# EAGLE design soundplank (EAGLE 6.2)
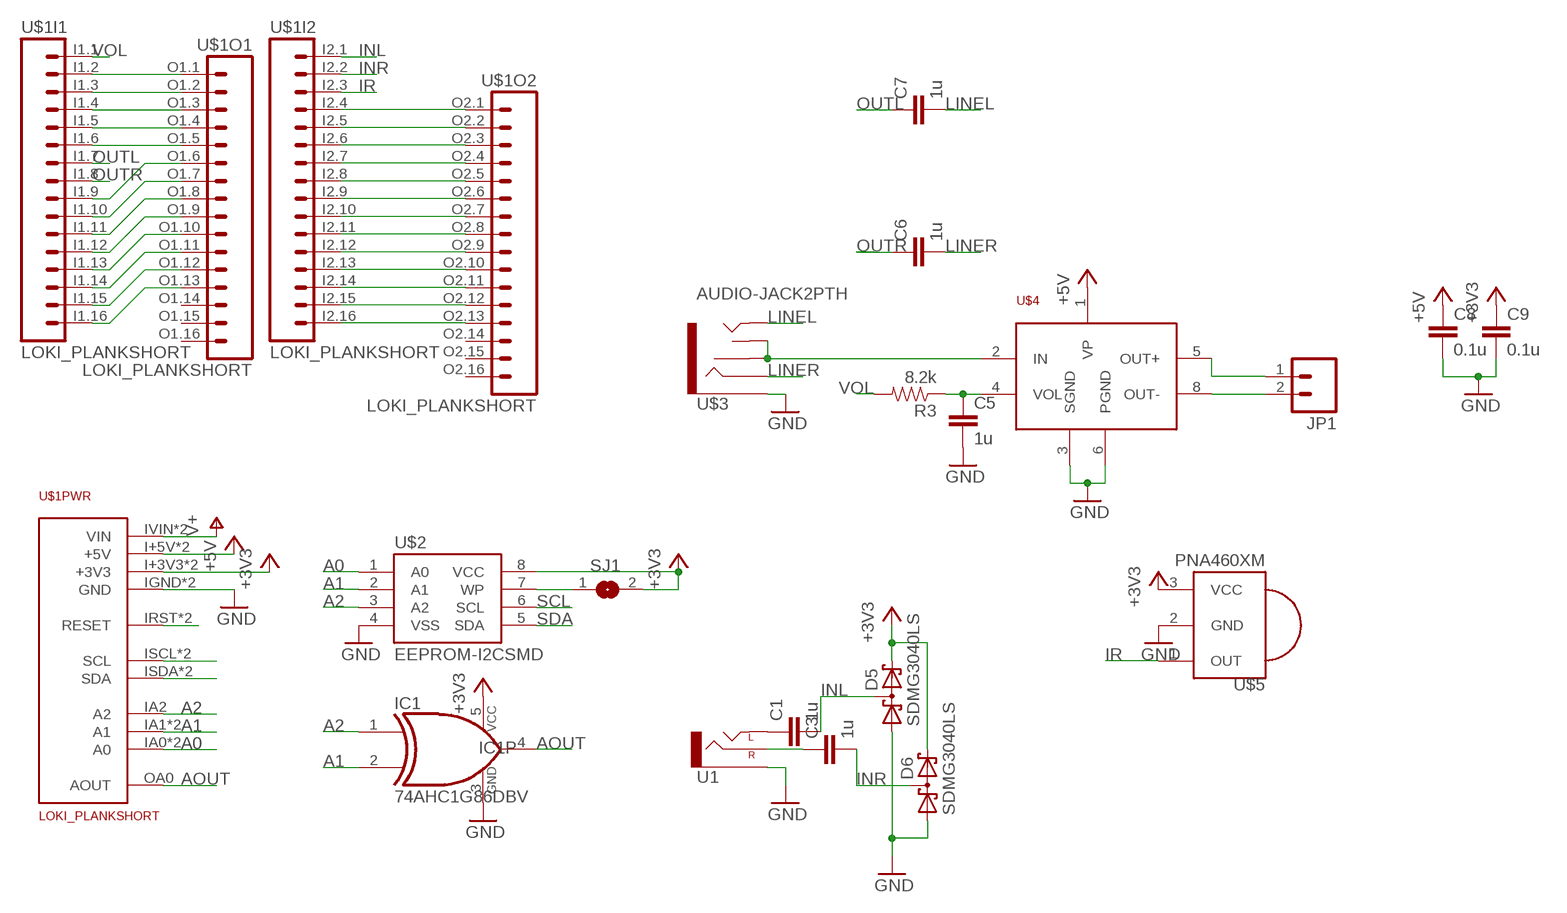
[diagram p0: schematic, sheet 1]

## Parts
C1  1u  CAP1210  [1210]
C3  1u  CAP1210  [1210]
C5  1u  CAP0805  [0805]
C6  1u  CAP1210  [1210]
C7  1u  CAP1210  [1210]
C8  0.1u  CAP0805  [0805]
C9  0.1u  CAP0805  [0805]
D5  SDMG3040LS  BAS40-04  [SOT23]
D6  SDMG3040LS  BAS40-04  [SOT23]
IC1  74AHC1G86DBV  [SOT23-5]
JP1  M023.5MM  [SCREWTERMINAL-3.5MM-2]
R3  8.2k  RESISTOR0805-RES  [0805]
SJ1  SJ  [SJ]
U1  AUDIO-JACKPTH  [AUDIO-JACK]
U$1  LOKI_PLANKSHORT  [PLANK_SHORT]
U$2  EEPROM-I2CSMD  [SO08]
U$3  AUDIO-JACK2PTH  [AUDIO-JACK]
U$4  TDA7052A  [SO08-MAX6675]
U$5  PNA460XM  [PNA460XM]

## Nets
+3V3: C9.1 D5.2(C2) D6.2(C2) IC1.5(VCC) SJ1.2 U$1.I+3V3(PWR:+3V3) U$1.O+3V3(PWR:+3V3) U$2.8(VCC) U$5.3(VCC)
+5V: C8.1 U$1.I+5V(PWR:+5V) U$1.O+5V(PWR:+5V) U$4.1(VP)
A0: U$1.IA0(PWR:A0) U$1.OA1(PWR:A0) U$2.1(A0)
A1: IC1.2(I1) U$1.IA1(PWR:A1) U$1.OA2(PWR:A1) U$2.2(A1)
A2: IC1.1(I0) U$1.IA2(PWR:A2) U$2.3(A2)
AOUT: IC1.4(O) U$1.OA0(PWR:AOUT)
GND: C5.2 C8.2 C9.2 D5.1(A1) D6.1(A1) IC1.3(GND) U1.SLEEVE U$1.IGND(PWR:GND) U$1.OGND(PWR:GND) U$2.4(VSS) U$3.SLEEVE U$4.3(SGND) U$4.6(PGND) U$5.2(GND)
INL: C1.2 D5.3(C1A2) U$1.I2.1
INR: C3.2 D6.3(C1A2) U$1.I2.2
IR: U$1.I2.3 U$5.1(OUT)
LINEL: C7.2 U$3.TIP
LINER: C6.2 U$3.RING
N$1: U$1.I1.2 U$1.O1.1
N$2: U$1.I1.3 U$1.O1.2
N$3: U$1.I1.4 U$1.O1.3
N$4: U$1.I1.5 U$1.O1.4
N$5: U$1.I1.6 U$1.O1.5
N$6: U$1.I1.9 U$1.O1.6
N$7: U$1.I1.10 U$1.O1.7
N$8: U$1.I1.11 U$1.O1.8
N$9: U$1.I1.12 U$1.O1.9
N$10: U$1.I1.13 U$1.O1.10
N$11: U$1.I1.14 U$1.O1.11
N$12: U$1.I1.15 U$1.O1.12
N$13: U$1.I1.16 U$1.O1.13
N$14: U$1.I2.16 U$1.O2.13
N$15: U$1.I2.15 U$1.O2.12
N$16: U$1.I2.14 U$1.O2.11
N$17: U$1.I2.13 U$1.O2.10
N$18: U$1.I2.12 U$1.O2.9
N$19: U$1.I2.11 U$1.O2.8
N$20: U$1.I2.10 U$1.O2.7
N$21: U$1.I2.9 U$1.O2.6
N$22: U$1.I2.8 U$1.O2.5
N$23: U$1.I2.7 U$1.O2.4
N$24: U$1.I2.6 U$1.O2.3
N$25: U$1.I2.5 U$1.O2.2
N$26: U$1.I2.4 U$1.O2.1
N$28: C5.1 R3.1 U$4.4(VOL)
N$30: JP1.2 U$4.8(OUT-)
N$31: SJ1.1 U$2.7(WP)
N$32: U$1.IRST(PWR:RESET) U$1.ORST(PWR:RESET)
N$33: JP1.1 U$4.5(OUT+)
N$34: C1.1 U1.TIP(LEFT)
N$38: U$3.RSH U$3.TSH U$4.2(IN)
N$39: C3.1 U1.RING(RIGHT)
OUTL: C7.1 U$1.I1.7
OUTR: C6.1 U$1.I1.8
SCL: U$1.ISCL(PWR:SCL) U$1.OSCL(PWR:SCL) U$2.6(SCL)
SDA: U$1.ISDA(PWR:SDA) U$1.OSDA(PWR:SDA) U$2.5(SDA)
V+: U$1.IVIN(PWR:VIN) U$1.OVIN(PWR:VIN)
VOL: R3.2 U$1.I1.1
Unconnected: U$1.O1.14 U$1.O1.15 U$1.O1.16 U$1.O2.14 U$1.O2.15 U$1.O2.16

## Library data of the parts
C1 C3 C5-C9 = SparkFun-Passives:CAP: Capacitor Standard 0603 ceramic capacitor, and 0.1" leaded capacitor.
D5 D6 = diode:BAS40-04: Silicon Schottky Diodes General-purpose diode for high-speed switching
IC1 = 74xx-little-us:74*1G86: 2-input EXCLUSIV-OR gate
JP1 = SparkFun-Connectors:M02: Header 2 Standard 2-pin 0.1" header. Use with straight break away headers (SKU : PRT-00116), right angle break away headers (PRT-00553), swiss pins (PRT-00743), machine pins (PRT-00117), and female headers (PRT-00115). Molex polarized connector foot print use with SKU : PRT-08233 with associated crimp pins and housings.
R3 = SparkFun-Passives:RESISTOR: Resistor Basic schematic elements and footprints for 0603, 1206, and PTH resistors.
SJ1 = jumper:SJ: SMD solder JUMPER
U1 = SparkFun-Connectors:AUDIO-JACK: 3.5mm Audio Jack Simple 3.5mm common PCB mount audio jack. SKU: PRT-08032
U$1 = loki:LOKI_PLANK: Expansion plank templates for Loki.
U$2 = SparkFun-DigitalIC:EEPROM-I2C: I2C EEPROM chips, 24LC256 (and others)
U$3 = SparkFun-Connectors:AUDIO-JACK2: Stereo audio jack with bypass switches.
U$4 = nickparts:TDA7052A
U$5 = adafruit:PNA460XM: IR 38KHz receiver PNA4602 and related receivers http://www.ladyada.net/library/pcb/eaglelibrary.html

## Board
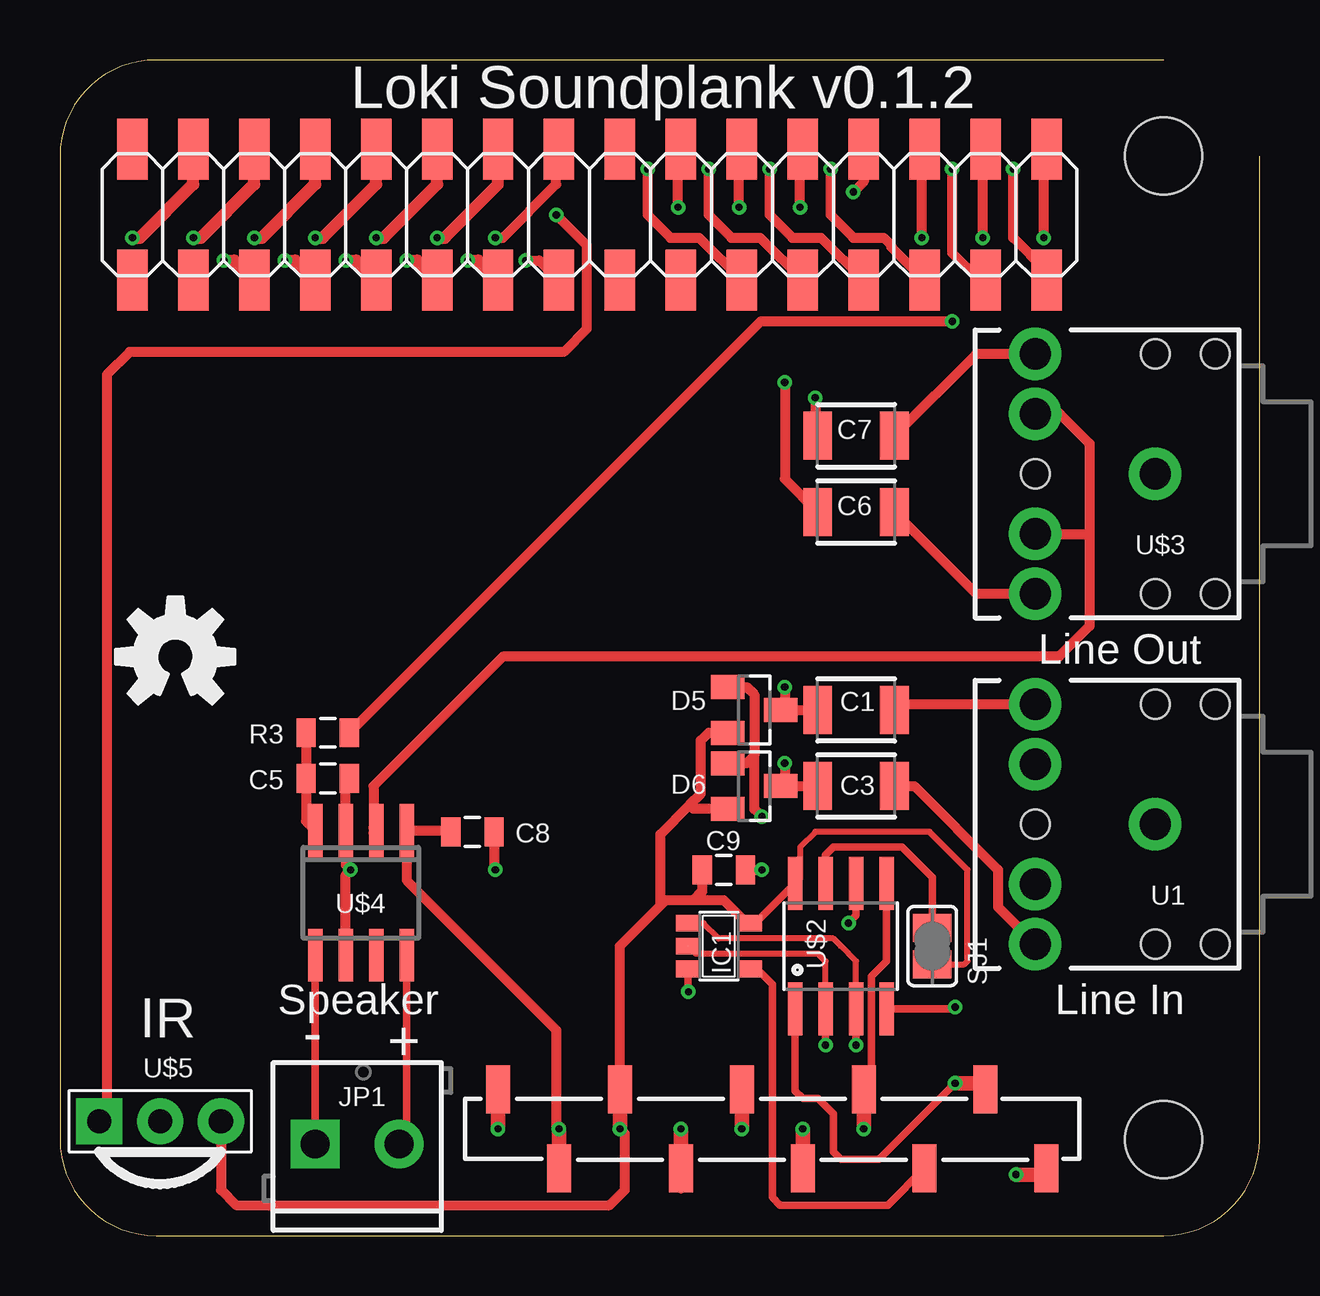
[diagram p1: board, top side]
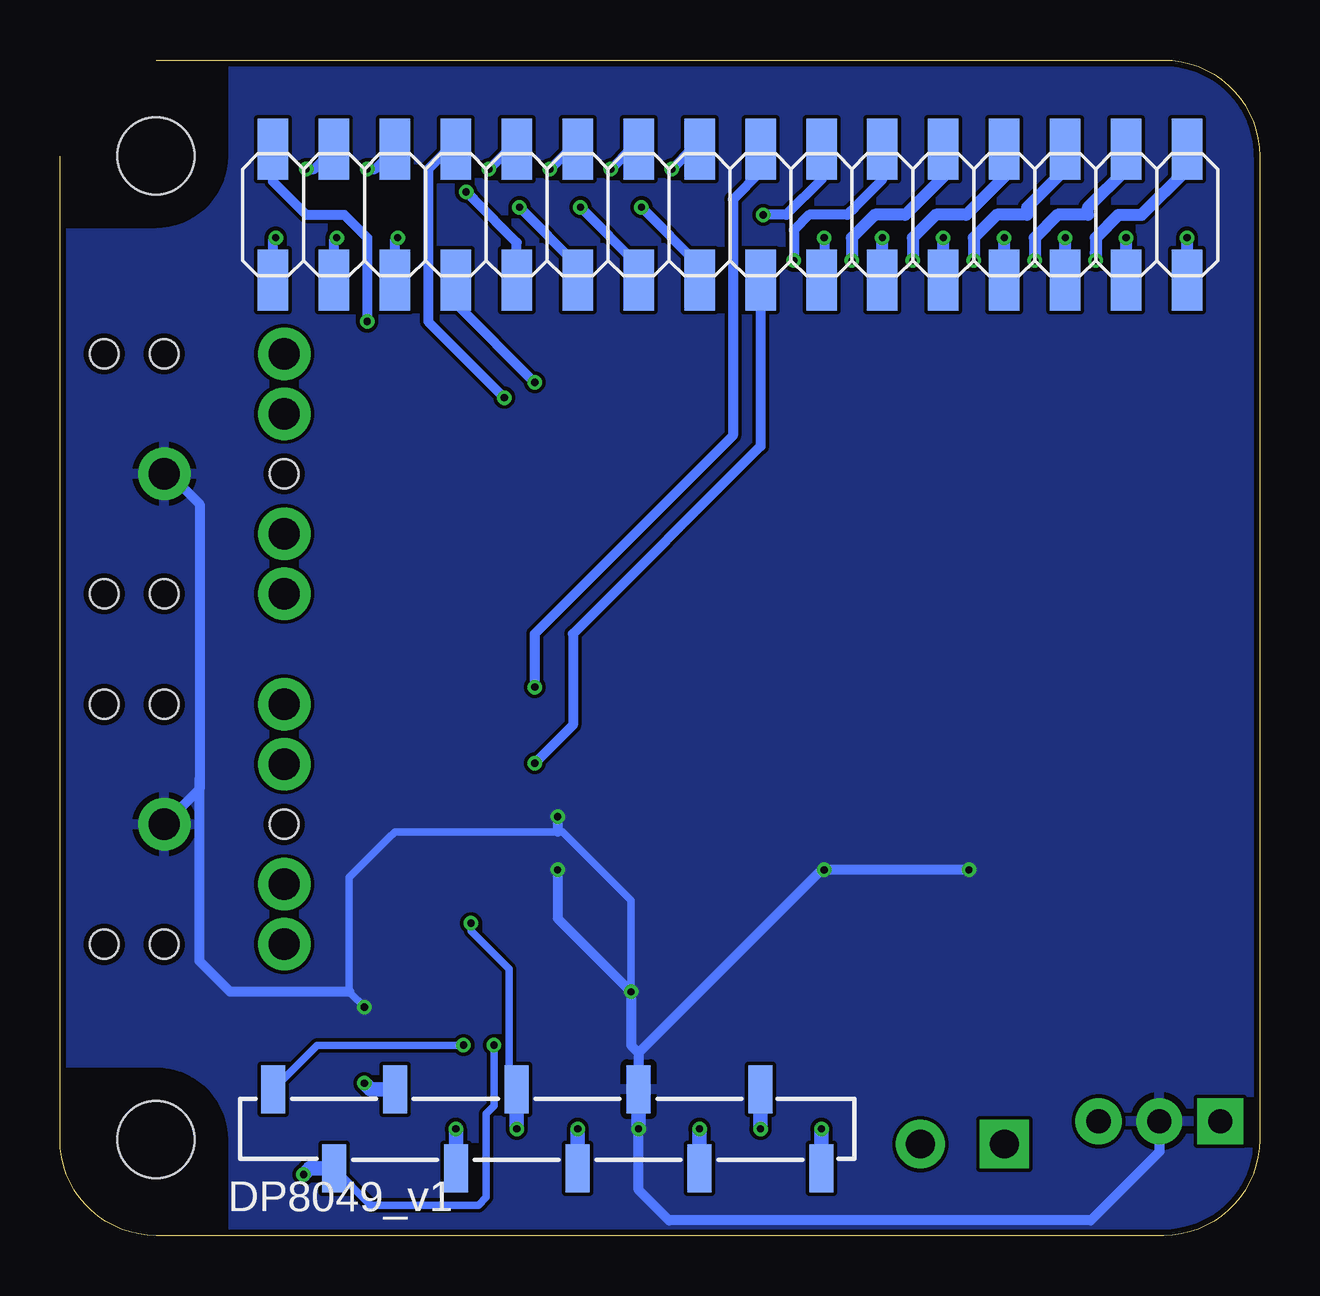
[diagram p2: board, bottom side, seen from below]

Size 50 x 49 mm. Coordinates in mm from the lower left corner, seen from the top.
Copper layers (1*16): Top 0.035mm / dielectric 1.5mm / Bottom 0.035mm
Design rules: minimum track width 6mil, minimum drill 0.3mm, track to track 6mil, track to pad 6mil, pad to pad 6mil, via to via 6mil, smd to smd 0mil, copper to edge 10mil, drill to drill 10mil, minimum pad ring 10mil, minimum via ring 6mil, stop-mask expansion 2mil, vias tented up to drill 100mil, thermal gap 10mil

### Footprints (pad centres in the part's own frame; a part is rotated, then mirrored left to right if it is on the bottom)
1210 = smd 1.2 x 2: 1 -1.6,0; 2 1.6,0
0805 = smd 0.8 x 1.2: 1 -0.9,0; 2 0.9,0
SOT23 = smd 1 x 1.4: 1 -0.95,-1.1; 2 0.95,-1.1; 3 0,1.1
SOT23-5 = smd 0.69 x 0.99: 1 -0.95,-1.29; 2 0,-1.29; 3 0.95,-1.29; 4 0.95,1.3; 5 -0.95,1.3
SCREWTERMINAL-3.5MM-2 = drill 1.2 pad 2.032 square: 1 0,0 | drill 1.2 pad 2.032: 2 3.5,0
SJ = smd 1.168 x 1.6: 1 -0.762,0; 2 0.762,0
AUDIO-JACK = drill 1.3 pad 2.184: RING 5,5; RSH 5,2.5; SLEEVE 0,0; TIP 5,-5; TSH 5,-2.5 | hole 1.2: 0,5; -2.5,5; -2.5,-5; 0,-5; 5,0
PLANK_SHORT = smd 1.27 x 2.54 bottom: I1.1 41.12,45.275; I1.2 41.12,39.815; I1.3 38.58,45.275; I1.4 38.58,39.815; I1.5 36.04,45.275; I1.6 36.04,39.815; I1.7 33.5,45.275; I1.8 33.5,39.815; I1.9 30.96,45.275; I1.10 30.96,39.815; I1.11 28.42,45.275; I1.12 28.42,39.815; I1.13 25.88,45.275; I1.14 25.88,39.815; I1.15 23.34,45.275; I1.16 23.34,39.815; I2.1 20.8,45.275; I2.2 20.8,39.815; I2.3 18.26,45.275; I2.4 18.26,39.815; I2.5 15.72,45.275; I2.6 15.72,39.815; I2.7 13.18,45.275; I2.8 13.18,39.815; I2.9 10.64,45.275; I2.10 10.64,39.815; I2.11 8.1,45.275; I2.12 8.1,39.815; I2.13 5.56,45.275; I2.14 5.56,39.815; I2.15 3.02,45.275; I2.16 3.02,39.815 | smd 1 x 2 bottom: I+3V3 23.34,2.795; I+5V 20.8,6.095; IA0 36.04,6.095; IA1 38.58,2.795; IA2 41.12,6.095; IGND 25.88,6.095; IRST 28.42,2.795; ISCL 30.96,6.095; ISDA 33.5,2.795; IVIN 18.26,2.795 | smd 1.27 x 2.54: O1.1 41.12,45.275; O1.2 41.12,39.815; O1.3 38.58,45.275; O1.4 38.58,39.815; O1.5 36.04,45.275; O1.6 36.04,39.815; O1.7 33.5,45.275; O1.8 33.5,39.815; O1.9 30.96,45.275; O1.10 30.96,39.815; O1.11 28.42,45.275; O1.12 28.42,39.815; O1.13 25.88,45.275; O1.14 25.88,39.815; O1.15 23.34,45.275; O1.16 23.34,39.815; O2.1 20.8,45.275; O2.2 20.8,39.815; O2.3 18.26,45.275; O2.4 18.26,39.815; O2.5 15.72,45.275; O2.6 15.72,39.815; O2.7 13.18,45.275; O2.8 13.18,39.815; O2.9 10.64,45.275; O2.10 10.64,39.815; O2.11 8.1,45.275; O2.12 8.1,39.815; O2.13 5.56,45.275; O2.14 5.56,39.815; O2.15 3.02,45.275; O2.16 3.02,39.815 | smd 1 x 2: O+3V3 23.34,6.095; O+5V 20.8,2.795; OA0 36.04,2.795; OA1 38.58,6.095; OA2 41.12,2.795; OGND 25.88,2.795; ORST 28.42,6.095; OSCL 30.96,2.795; OSDA 33.5,6.095; OVIN 18.26,6.095 | hole 3.2: 46,4; 46,45
SO08 = smd 0.61 x 2.21: 1 -1.905,-2.616; 2 -0.635,-2.616; 3 0.635,-2.616; 4 1.905,-2.616; 5 1.905,2.616; 6 0.635,2.616; 7 -0.635,2.616; 8 -1.905,2.616
SO08-MAX6675 = smd 0.6 x 2.2: 1 -1.905,-2.6; 2 -0.635,-2.6; 3 0.635,-2.6; 4 1.905,-2.6; 5 1.905,2.6; 6 0.635,2.6; 7 -0.635,2.6; 8 -1.905,2.6
PNA460XM = drill 1.016 pad 1.93 square: 1 -2.54,0 | drill 1.016 pad 1.93: 2 0,0; 3 2.54,0

### Placement (x,y rotation side)
C1  33.18,21.91 180 top
C3  33.18,18.73 180 top
C5  11.16,19.05 0 top
C6  33.18,30.16 0 top
C7  33.18,33.34 0 top
C8  17.19,16.83 0 top
C9  27.67,15.24 0 top
D5  28.94,21.91 270 top
D6  28.94,18.73 270 top
IC1  27.47,12.06 270 top
JP1  10.64,3.81 0 top
R3  11.16,20.95 0 top
SJ1  36.36,12.06 270 top
U1  45.65,17.14 180 top
U$1  0,0 0 top
U$2  32.55,12.06 0 top
U$3  45.65,31.75 180 top
U$4  12.54,14.29 180 top
U$5  4.18,4.76 0 top
U$6  [OSHW-LOGO-M]  4.81,24.13 0 top

### Tracks (layer width: path | path; a pad name or v marks a point on that pad's centre or on a via)
+3V3  (via drill 0.3)
  Top 0.254: SJ1.2 37.7,11.3 37.83,11.43 37.83,15.24 36.56,16.51 36.24,16.83 31.48,16.83 30.84,16.19 30.84,14.88 U$2.8
  Top 0.305: IC1.5 28.98,13.02 U$2.8
  Top 0.406: IC1.5 28.62,13.02 27.67,13.97 26.4,13.97 | 26.4,13.97 25.25,13.97 25.03,13.75 | U$1.O+3V3 23.34,12.06 25.03,13.75 | C9.1 26.77,14.34 26.4,13.97 | U$5.3 6.71,1.91 7.35,1.27 22.91,1.27 23.54,1.91 23.54,4.24 v23.34,4.45 | D6.2 26.4,17.78 26.24,17.94 | 25.03,13.75 25.03,16.73 26.24,17.94 | 26.24,17.94 26.72,18.41 26.72,20.64 27.04,20.95 D5.2
  Top 0.61: U$1.O+3V3 v23.34,4.45
  Bottom 0.61: v23.34,4.45 U$1.I+3V3
+5V  (via drill 0.3)
  Top 0.406: 20.68,4.56 v20.8,4.45 20.68,4.56 | C8.1 16.23,16.89 U$4.1 14.45,15.76 14.45,14.81 20.68,8.57 20.68,4.56
  Top 0.61: v20.8,4.45 U$1.O+5V
  Bottom 0.61: U$1.I+5V v20.8,4.45
A0  (via drill 0.3)
  Top 0.305: U$2.1 30.64,6.03 30.96,5.71 31.59,5.71 32.23,5.08 32.23,3.49 32.55,3.17 34.13,3.17 v37.31,6.35
  Top 0.61: v37.31,6.35 38.32,6.35 U$1.OA1
  Bottom 0.305: 35.98,6.03 U$1.IA0
  Bottom 0.61: U$1.IA0 37.05,6.09 v37.31,6.35
A1  (via drill 0.3)
  Top 0.254: U$2.2 31.91,11.43 31.59,11.75 26.5,11.75 IC1.2
  Top 0.305: U$2.2 v31.91,7.94
  Top 0.61: v39.85,2.54 40.86,2.54 U$1.OA2
  Bottom 0.305: U$1.IA1 37.05,1.27 32.55,1.27 32.23,1.59 32.23,5.08 31.91,5.4 v31.91,7.94
  Bottom 0.61: U$1.IA1 39.59,2.79 v39.85,2.54
A2  (via drill 0.3)
  Top 0.254: U$2.3 33.18,11.43 32.55,12.06 32.23,12.38 27.47,12.38 26.83,13.02 IC1.1
  Top 0.305: U$2.3 v33.18,7.94
  Bottom 0.305: v33.18,7.94 39.28,7.94 U$1.IA2
AOUT
  Top 0.305: IC1.4 29.05,11.12 29.69,10.48 29.69,1.59 30.01,1.27 34.51,1.27 U$1.OA0
GND  (via drill 0.3)
  Top 0.305: 25.88,1.91 U$1.OGND | IC1.3 26.18,10.18 v26.2,10.16 | U$2.4 35.29,9.45 37.23,9.45 v37.31,9.53
  Top 0.406: C8.2 18.09,15.29 v18.14,15.24 | C9.2 v29.26,15.24 | C5.2 11.91,18.9 U$4.3 11.91,15.44 v12.11,15.24 11.91,15.04 U$4.6 | D6.1 | D5.1 28.62,22.86 28.94,22.54 28.94,20 | 28.94,20 28.62,19.68 D6.1 | v29.26,17.46 28.94,17.78 28.94,20
  Top 0.61: v25.88,4.45 U$1.OGND
  Bottom 0.305: v37.31,9.53 37.89,10.1 37.95,10.16 37.95,14.92 36.2,16.67 36.14,16.73 36.04,16.83 29.26,16.83 29.05,16.83 29,16.77 26.2,13.97 v26.2,10.16
  Bottom 0.406: v12.11,15.24 v18.14,15.24 18.26,15.24 25.88,7.62 | 25.88,7.62 U$1.IGND | 25.88,7.62 26.2,7.94 v26.2,10.16 29.26,13.22 v29.26,15.24 | U$5.2 4.18,3.49 7.03,0.64 24.61,0.64 25.88,1.91 v25.88,4.45 | v29.26,17.46 29.26,16.83 | U$3.SLEEVE 45.45,31.75 44.18,30.48 44.18,19.05 | 44.18,19.05 44.18,18.62 U1.SLEEVE | 37.95,10.16 42.91,10.16 44.18,11.43 44.18,19.05
  Bottom 0.61: U$1.IGND v25.88,4.45
  pour Bottom: -0.27,0 -0.27,49.53 50.53,49.53 50.53,0
INL  (via drill 0.3)
  Top 0.406: C1.2 D5.3 30.21,22.08 v30.21,22.86
  Bottom 0.406: U$1.I2.1 20.8,44.34 21.96,43.18 21.96,33.34 30.21,25.08 v30.21,22.86
INR  (via drill 0.3)
  Top 0.406: C3.2 D6.3 30.21,18.9 v30.21,19.68
  Bottom 0.406: U$1.I2.2 20.8,32.91 28.62,25.08 28.62,21.27 v30.21,19.68
IR  (via drill 0.3)
  Top 0.406: v20.68,42.55 21.96,41.27 21.96,37.78 21,36.83 2.9,36.83 1.95,35.88 1.95,31.43 1.95,5.08 U$5.1
  Bottom 0.406: U$1.I2.3 18.26,44.02 19.73,42.55 v20.68,42.55
LINEL
  Top 0.406: U$3.TIP 38.2,36.75 C7.2
LINER
  Top 0.406: U$3.RING 38.2,26.75 C6.2
N$1  (via drill 0.3)
  Top 0.406: v41,41.59 41,45.16 U$1.O1.1
  Bottom 0.406: U$1.I1.2 41.12,41.48 v41,41.59
N$2  (via drill 0.3)
  Top 0.406: U$1.O1.2 41.12,40.21 39.73,41.59 v39.73,44.45
  Bottom 0.406: v39.73,44.45 39.4,44.45 U$1.I1.3
N$3  (via drill 0.3)
  Top 0.406: v38.46,41.59 38.46,45.16 U$1.O1.3
  Bottom 0.406: U$1.I1.4 38.58,41.48 v38.46,41.59
N$4  (via drill 0.3)
  Top 0.406: U$1.O1.4 38.34,39.81 37.2,40.96 v37.2,44.45
  Bottom 0.406: v37.2,44.45 36.86,44.45 U$1.I1.5
N$5  (via drill 0.3)
  Top 0.406: v35.92,41.59 35.92,45.16 U$1.O1.5
  Bottom 0.406: U$1.I1.6 36.04,41.48 v35.92,41.59
N$6  (via drill 0.3)
  Top 0.406: v32.11,44.45 32.11,42.55 33.07,41.59 34.34,41.59 34.65,41.27 34.65,41.2 U$1.O1.6
  Bottom 0.406: U$1.I1.9 31.29,45.27 v32.11,44.45
N$7  (via drill 0.3)
  Top 0.406: U$1.O1.7 33.5,43.93 v33.07,43.5
  Bottom 0.406: U$1.I1.10 30.96,41.39 32.75,43.18 v33.07,43.5
N$8  (via drill 0.3)
  Top 0.406: v29.57,44.45 29.57,42.55 30.53,41.59 31.72,41.59 U$1.O1.8
  Bottom 0.406: U$1.I1.11 28.75,45.27 v29.57,44.45
N$9  (via drill 0.3)
  Top 0.406: v30.84,42.86 30.84,45.16 U$1.O1.9
  Bottom 0.406: U$1.I1.12 28.42,40.44 v30.84,42.86
N$10  (via drill 0.3)
  Top 0.406: v27.04,44.45 27.04,42.55 27.99,41.59 29.18,41.59 U$1.O1.10
  Bottom 0.406: U$1.I1.13 26.21,45.27 v27.04,44.45
N$11  (via drill 0.3)
  Top 0.406: v28.3,42.86 28.3,45.16 U$1.O1.11
  Bottom 0.406: U$1.I1.14 25.88,40.44 v28.3,42.86
N$12  (via drill 0.3)
  Top 0.406: v24.5,44.45 24.5,42.55 25.45,41.59 26.64,41.59 U$1.O1.12
  Bottom 0.406: U$1.I1.15 23.67,45.27 v24.5,44.45
N$13  (via drill 0.3)
  Top 0.406: v25.77,42.86 25.77,45.16 U$1.O1.13
  Bottom 0.406: U$1.I1.16 23.34,40.44 v25.77,42.86
N$14  (via drill 0.3)
  Top 0.508: v3.02,41.59 3.34,41.59 5.56,43.81 U$1.O2.13
  Bottom 0.508: U$1.I2.16 v3.02,41.59
N$15  (via drill 0.3)
  Top 0.508: v6.83,40.64 7.28,40.64 U$1.O2.12
  Bottom 0.508: v6.83,40.64 6.83,40.96 6.83,41.59 5.88,42.55 4.93,42.55 3.02,44.45 U$1.I2.15
N$16  (via drill 0.3)
  Top 0.508: v5.56,41.59 5.88,41.59 8.1,43.81 U$1.O2.11
  Bottom 0.508: U$1.I2.14 v5.56,41.59
N$17  (via drill 0.3)
  Top 0.508: v9.37,40.64 9.82,40.64 U$1.O2.10
  Bottom 0.508: v9.37,40.64 9.37,41.59 8.42,42.55 7.15,42.55 7.15,42.86 5.56,44.45 U$1.I2.13
N$18  (via drill 0.3)
  Top 0.508: v8.1,41.59 8.42,41.59 10.64,43.81 U$1.O2.9
  Bottom 0.508: U$1.I2.12 v8.1,41.59
N$19  (via drill 0.3)
  Top 0.508: v11.91,40.64 12.36,40.64 U$1.O2.8
  Bottom 0.508: v11.91,40.64 11.91,41.59 10.96,42.55 9.69,42.55 9.69,42.86 8.1,44.45 U$1.I2.11
N$20  (via drill 0.3)
  Top 0.508: v10.64,41.59 10.96,41.59 13.18,43.81 U$1.O2.7
  Bottom 0.508: U$1.I2.10 v10.64,41.59
N$21  (via drill 0.3)
  Top 0.508: v14.45,40.64 14.89,40.64 U$1.O2.6
  Bottom 0.508: U$1.I2.9 10.64,44.13 12.23,42.55 13.5,42.55 14.45,41.59 v14.45,40.64
N$22  (via drill 0.3)
  Top 0.508: v13.18,41.59 13.5,41.59 15.72,43.81 U$1.O2.5
  Bottom 0.508: U$1.I2.8 v13.18,41.59
N$23  (via drill 0.3)
  Top 0.508: v16.99,40.64 17.43,40.64 U$1.O2.4
  Bottom 0.508: U$1.I2.7 13.18,44.13 14.77,42.55 16.04,42.55 16.99,41.59 v16.99,40.64
N$24  (via drill 0.3)
  Top 0.508: v15.72,41.59 16.04,41.59 18.26,43.81 U$1.O2.3
  Bottom 0.508: U$1.I2.6 15.72,41.27 v15.72,41.59
N$25  (via drill 0.3)
  Top 0.406: v19.41,40.64 19.98,40.64 U$1.O2.2
  Bottom 0.406: U$1.I2.5 15.72,44.02 16.88,42.86 17.19,42.55 18.78,42.55 19.41,41.91 v19.41,40.64
N$26  (via drill 0.3)
  Top 0.406: v18.14,41.59 18.46,41.59 20.68,43.81 20.68,45.16 U$1.O2.1
  Bottom 0.406: v18.14,41.59 18.14,39.93 U$1.I2.4
N$28
  Top 0.406: R3.1 C5.1 10.26,17.27 U$4.4
N$30
  Top 0.305: U$4.8 14.45,4.12 JP1.2
N$31
  Top 0.305: SJ1.1 36.36,14.92 35.09,16.19 32.23,16.19 31.91,15.88 U$2.7
N$32  (via drill 0.3)
  Top 0.61: U$1.ORST v28.42,4.45
  Bottom 0.61: v28.42,4.45 U$1.IRST
N$33
  Top 0.305: U$4.5 JP1.1
N$34
  Top 0.406: U1.TIP 35.02,22.14 C1.1
N$38
  Top 0.406: 13.07,16.77 U$4.2 | 13.07,17 U$4.2 | 13.07,17 U$4.2 | 13.07,17 13.07,18.73 18.46,24.13 41.64,24.13 42.91,25.4 42.91,29.21 | 13.07,17 U$4.2 | U$3.TSH 41.68,34.25 42.91,33.02 42.91,29.21 | U$3.RSH 42.87,29.25 42.91,29.21
N$39
  Top 0.406: C3.1 35.61,18.73 39.1,15.24 39.1,13.7 U1.RING
OUTL  (via drill 0.3)
  Top 0.406: v31.48,34.92 31.48,33.44 C7.1
  Bottom 0.406: U$1.I1.7 33.83,45.27 34.65,44.45 34.65,38.1 v31.48,34.92
OUTR  (via drill 0.3)
  Top 0.406: v30.21,35.56 30.21,31.54 C6.1
  Bottom 0.406: U$1.I1.8 33.5,38.85 v30.21,35.56
SCL  (via drill 0.3)
  Top 0.305: U$2.6 33.18,13.34 v32.86,13.02
  Top 0.61: v30.96,4.45 U$1.OSCL
  Bottom 0.305: v32.86,13.02 32.86,12.7 31.28,11.11 31.28,6.41 U$1.ISCL
  Bottom 0.61: U$1.ISCL v30.96,4.45
SDA  (via drill 0.3)
  Top 0.305: U$2.5 34.45,11.43 33.82,10.79 33.82,6.41 U$1.OSDA
  Top 0.61: U$1.OSDA v33.5,4.45
  Bottom 0.61: v33.5,4.45 U$1.ISDA
V+  (via drill 0.3)
  Top 0.61: U$1.OVIN v18.26,4.45
  Bottom 0.61: v18.26,4.45 U$1.IVIN
VOL  (via drill 0.3)
  Top 0.406: v37.2,38.1 29.21,38.1 R3.2
  Bottom 0.406: U$1.I1.1 41.12,43.93 39.73,42.55 38.15,42.55 37.2,41.59 v37.2,38.1

### Text on the board
tPlace: Loki Soundplank v0.1.2 | Line Out | Speaker | Line In | - | +
tNames: IR